# EAGLE schematic analog_effects (EAGLE 9.6.2)

## Sheet 1 of 2
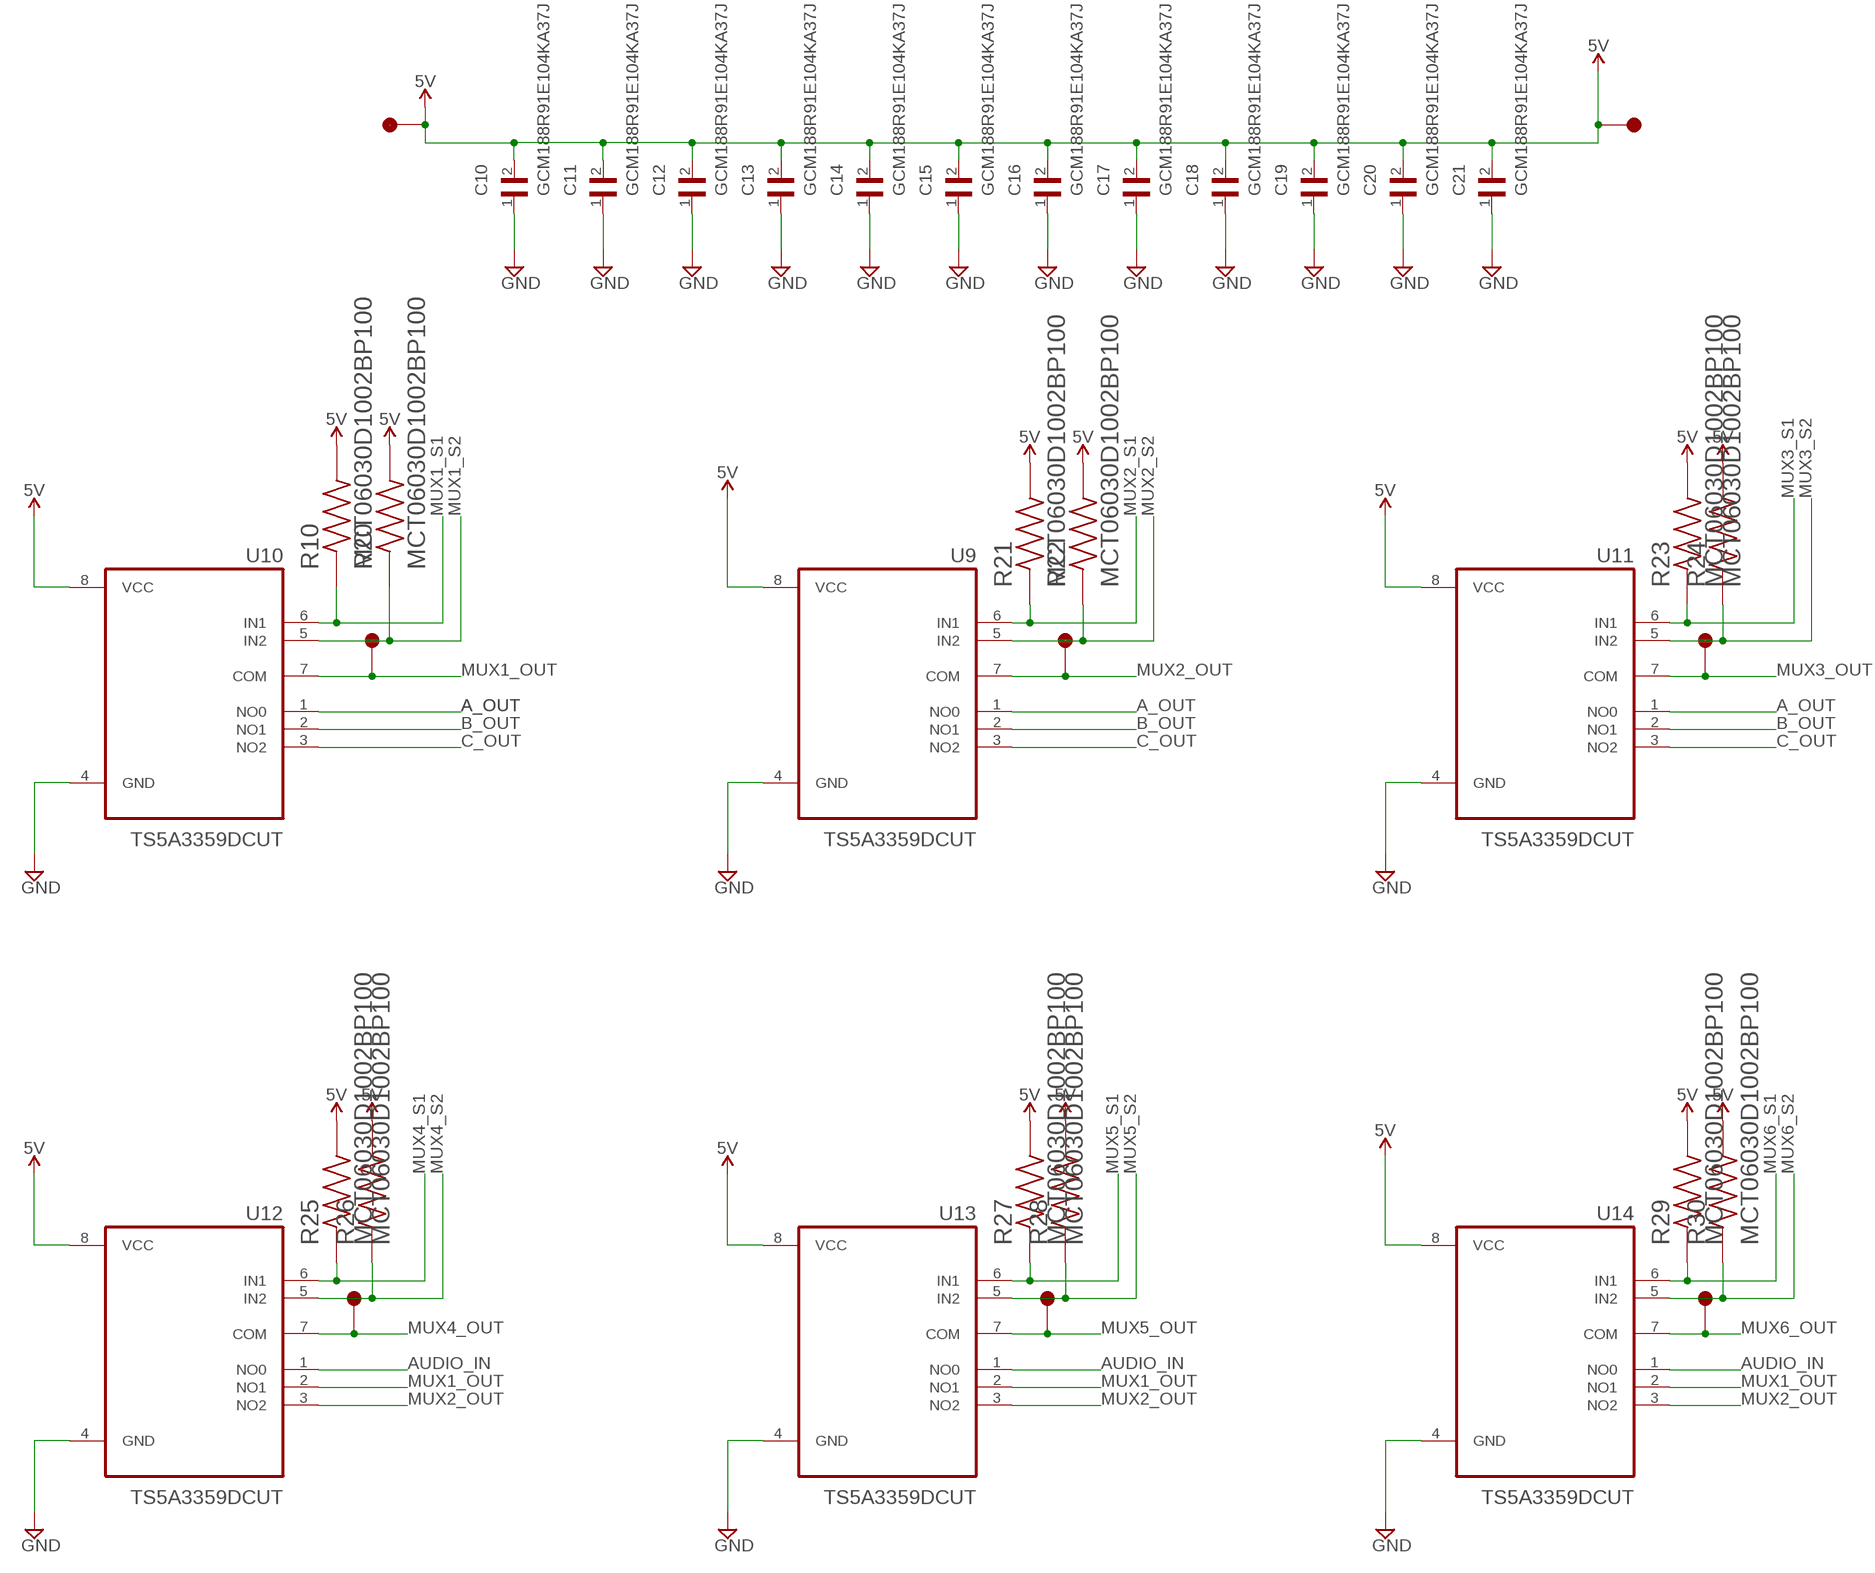
[diagram p0: schematic, sheet 1]

### Parts
C10  GCM188R91E104KA37J  [CAPC1608X90N]
C11  GCM188R91E104KA37J  [CAPC1608X90N]
C12  GCM188R91E104KA37J  [CAPC1608X90N]
C13  GCM188R91E104KA37J  [CAPC1608X90N]
C14  GCM188R91E104KA37J  [CAPC1608X90N]
C15  GCM188R91E104KA37J  [CAPC1608X90N]
C16  GCM188R91E104KA37J  [CAPC1608X90N]
C17  GCM188R91E104KA37J  [CAPC1608X90N]
C18  GCM188R91E104KA37J  [CAPC1608X90N]
C19  GCM188R91E104KA37J  [CAPC1608X90N]
C20  GCM188R91E104KA37J  [CAPC1608X90N]
C21  GCM188R91E104KA37J  [CAPC1608X90N]
R10  MCT06030D1002BP100  [RESC1508X55N]
R20  MCT06030D1002BP100  [RESC1508X55N]
R21  MCT06030D1002BP100  [RESC1508X55N]
R22  MCT06030D1002BP100  [RESC1508X55N]
R23  MCT06030D1002BP100  [RESC1508X55N]
R24  MCT06030D1002BP100  [RESC1508X55N]
R25  MCT06030D1002BP100  [RESC1508X55N]
R26  MCT06030D1002BP100  [RESC1508X55N]
R27  MCT06030D1002BP100  [RESC1508X55N]
R28  MCT06030D1002BP100  [RESC1508X55N]
R29  MCT06030D1002BP100  [RESC1508X55N]
R30  MCT06030D1002BP100  [RESC1508X55N]
TP13  5015  [KEYSTONE_5015]
TP14  5015  [KEYSTONE_5015]
TP15  5015  [KEYSTONE_5015]
TP16  5015  [KEYSTONE_5015]
TP17  5015  [KEYSTONE_5015]
TP18  5015  [KEYSTONE_5015]
TP19  5015  [KEYSTONE_5015]
TP20  5015  [KEYSTONE_5015]
U9  TS5A3359DCUT  [SOP50P310X90-8N]
U10  TS5A3359DCUT  [SOP50P310X90-8N]
U11  TS5A3359DCUT  [SOP50P310X90-8N]
U12  TS5A3359DCUT  [SOP50P310X90-8N]
U13  TS5A3359DCUT  [SOP50P310X90-8N]
U14  TS5A3359DCUT  [SOP50P310X90-8N]

### Nets
5V: C10.2 C11.2 C12.2 C13.2 C14.2 C15.2 C16.2 C17.2 C18.2 C19.2 C20.2 C21.2 R10.2 R20.2 R21.2 R22.2 R23.2 R24.2 R25.2 R26.2 R27.2 R28.2 R29.2 R30.2 TP19.1(TP) TP20.1(TP) U9.8(VCC) U10.8(VCC) U11.8(VCC) U12.8(VCC) U13.8(VCC) U14.8(VCC) ; also sheet 2
A_OUT: U9.1(NO0) U10.1(NO0) U11.1(NO0) ; also sheet 2
AUDIO_IN: U12.1(NO0) U13.1(NO0) U14.1(NO0) ; also sheet 2
B_OUT: U9.2(NO1) U10.2(NO1) U11.2(NO1) ; also sheet 2
C_OUT: U9.3(NO2) U10.3(NO2) U11.3(NO2)
GND: C10.1 C11.1 C12.1 C13.1 C14.1 C15.1 C16.1 C17.1 C18.1 C19.1 C20.1 C21.1 U9.4(GND) U10.4(GND) U11.4(GND) U12.4(GND) U13.4(GND) U14.4(GND) ; also sheet 2
MUX1_OUT: TP16.1(TP) U10.7(COM) U12.2(NO1) U13.2(NO1) U14.2(NO1)
MUX1_S1: R10.1 U10.6(IN1) ; also sheet 2
MUX1_S2: R20.1 U10.5(IN2) ; also sheet 2
MUX2_OUT: TP17.1(TP) U9.7(COM) U12.3(NO2) U13.3(NO2) U14.3(NO2)
MUX2_S1: R21.1 U9.6(IN1) ; also sheet 2
MUX2_S2: R22.1 U9.5(IN2) ; also sheet 2
MUX3_OUT: TP18.1(TP) U11.7(COM)
MUX3_S1: R23.1 U11.6(IN1) ; also sheet 2
MUX3_S2: R24.1 U11.5(IN2) ; also sheet 2
MUX4_OUT: TP13.1(TP) U12.7(COM) ; also sheet 2
MUX4_S1: R25.1 U12.6(IN1) ; also sheet 2
MUX4_S2: R26.1 U12.5(IN2) ; also sheet 2
MUX5_OUT: TP14.1(TP) U13.7(COM) ; also sheet 2
MUX5_S1: R27.1 U13.6(IN1) ; also sheet 2
MUX5_S2: R28.1 U13.5(IN2) ; also sheet 2
MUX6_OUT: TP15.1(TP) U14.7(COM) ; also sheet 2
MUX6_S1: R29.1 U14.6(IN1) ; also sheet 2
MUX6_S2: R30.1 U14.5(IN2) ; also sheet 2

## Sheet 2 of 2
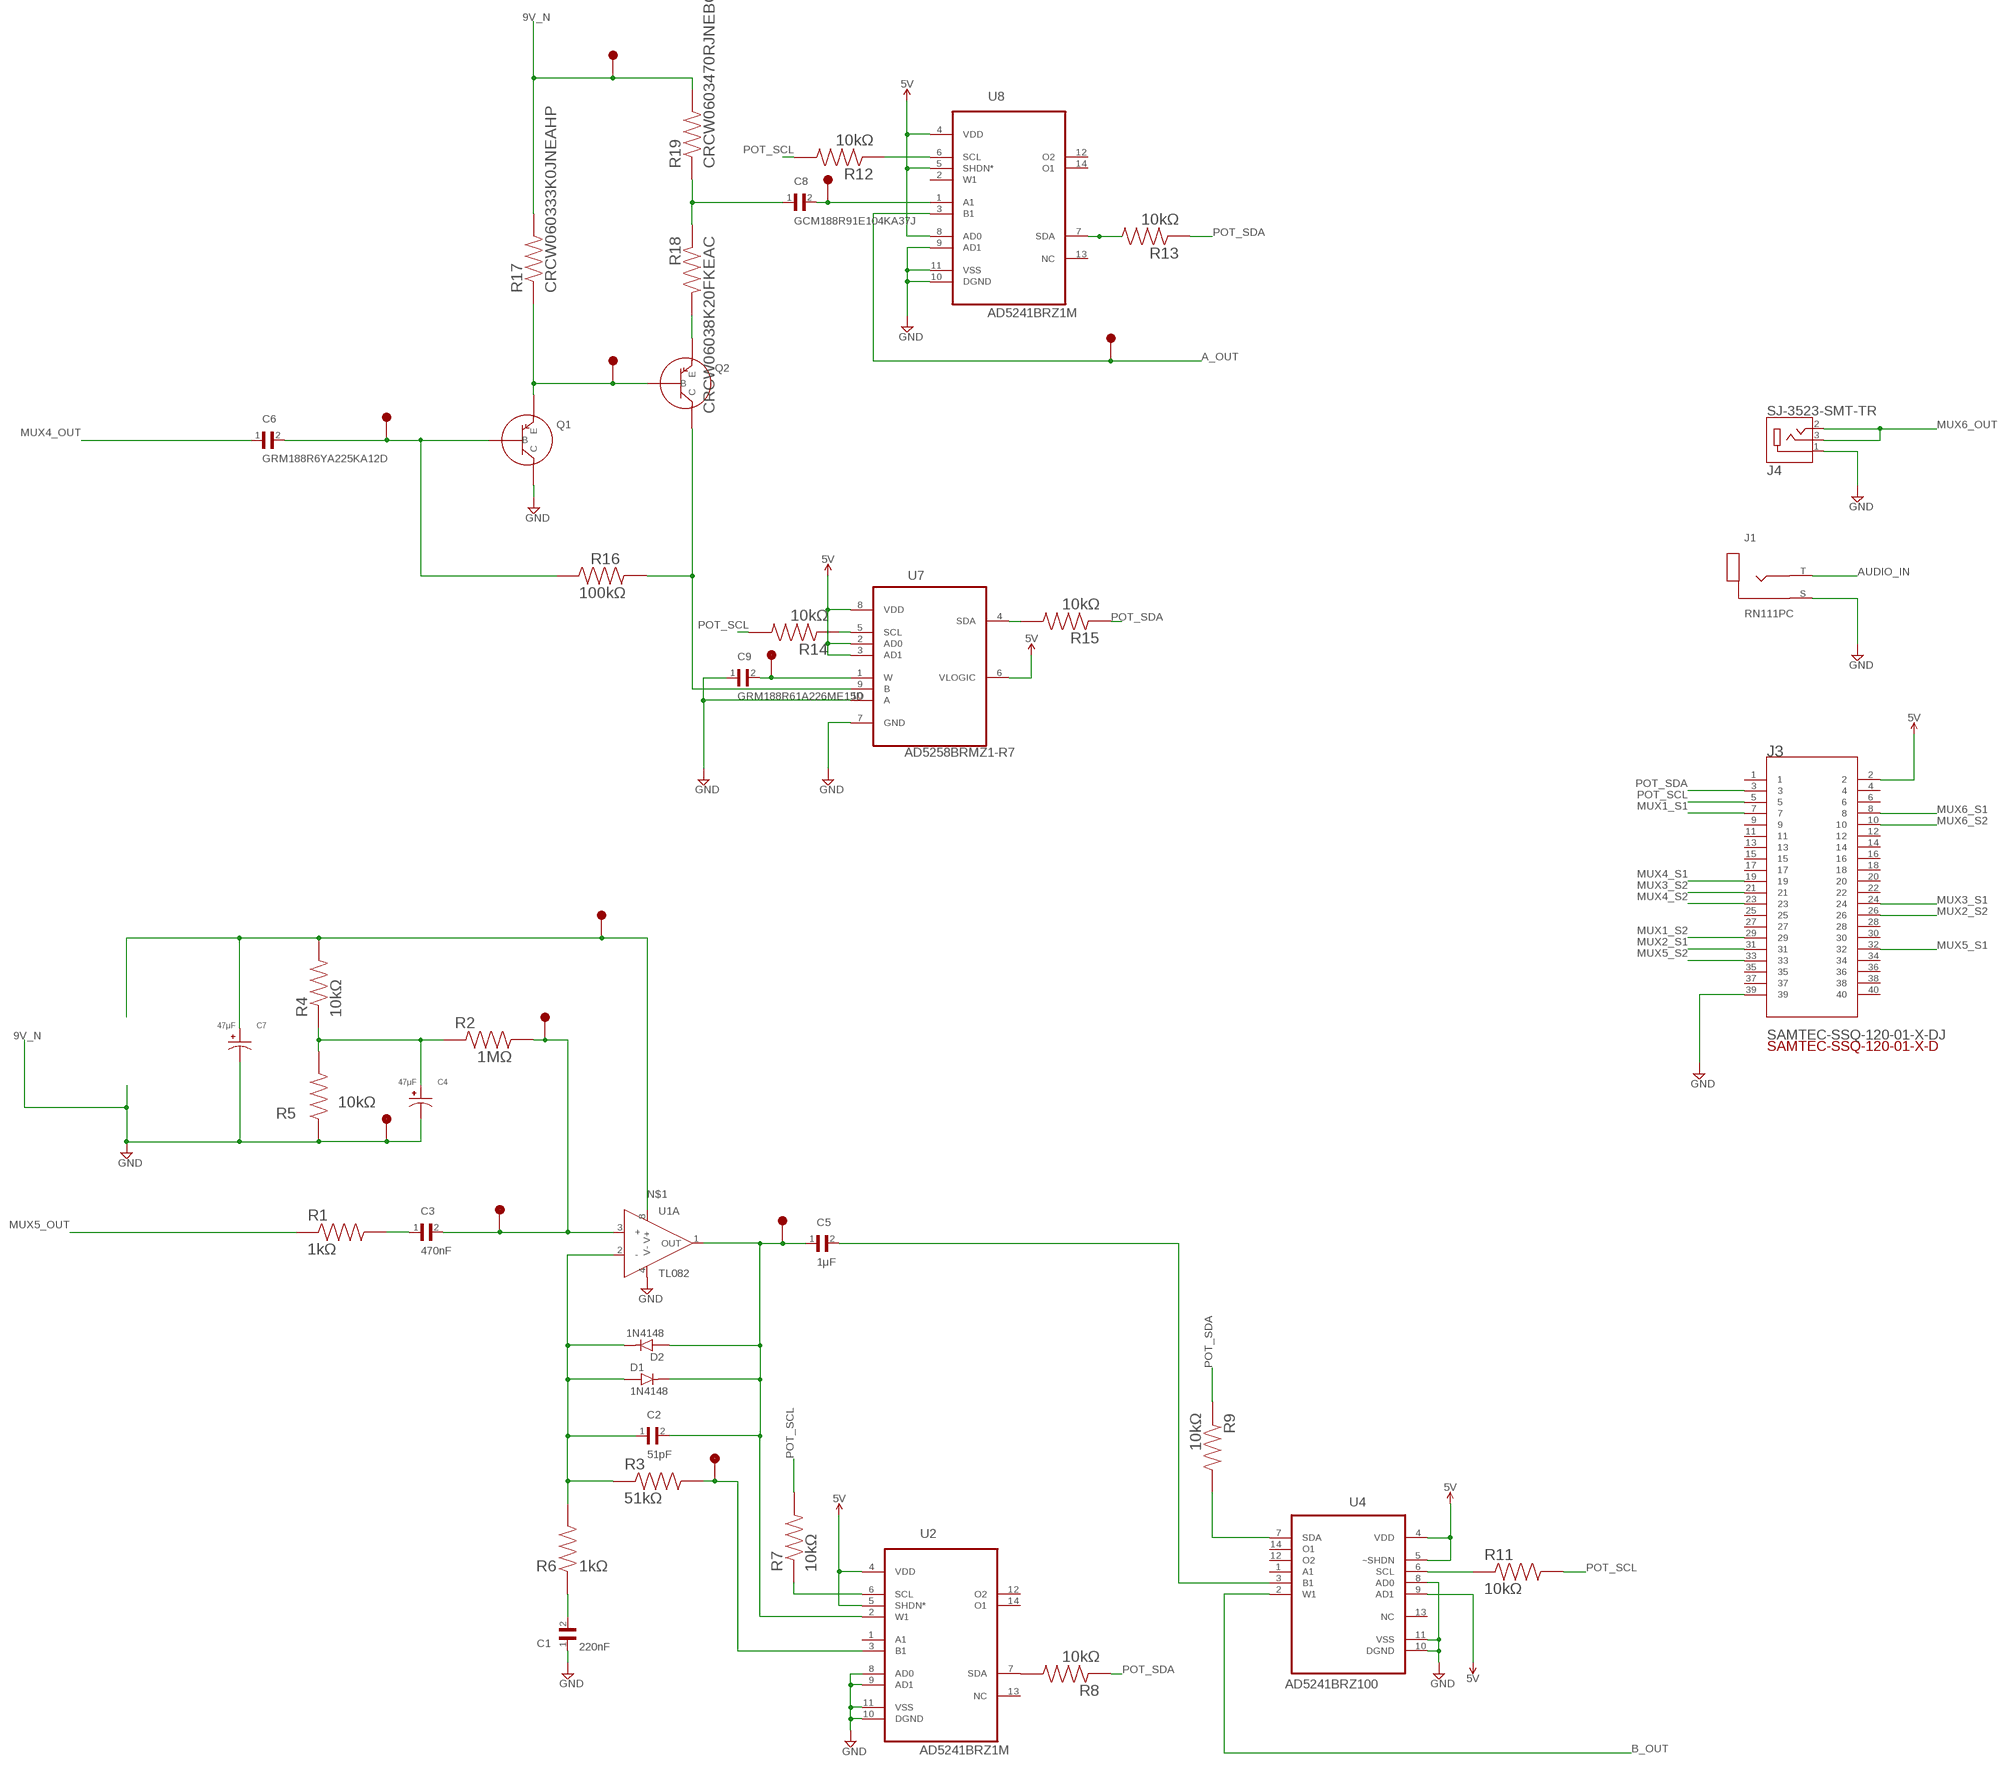
[diagram p1: schematic, sheet 2]

### Parts
C1  220nF  12105C224MAT2A  [CAPC3325X94N]
C2  51pF  C0603C510F1GACTU  [CAPC1608X87N]
C3  470nF  CGA3E3X7R1H474M080AE  [CAPC1608X95N]
C4  47μF  EEE-HC1E470XP  [CAPAE660X800N]
C5  1μF  GCM188R71C105KA64J  [CAPC1608X90N]
C6  GRM188R6YA225KA12D  [CAPC1608X90N]
C7  47μF  EEE-HC1E470XP  [CAPAE660X800N]
C8  GCM188R91E104KA37J  [CAPC1608X90N]
C9  GRM188R61A226ME15D  [CAPC1608X100N]
D1  1N4148  [DIOAD829W49L456D191]
D2  1N4148  [DIOAD829W49L456D191]
J1  RN111PC  [SWITCHCRAFT_RN111PC]
J3  SAMTEC-SSQ-120-01-X-DJ  [SAMTEC-SSQ-120-01-X-D]
J4  SJ-3523-SMT-TR  [CUI_SJ-3523-SMT-TR]
Q1  BJT_PNP  (no package)
Q2  BJT_PNP  (no package)
R1  1kΩ  CPF0603B1K0E1  [RESC1508X55N]
R2  1MΩ  CRCW06031M00JNEAHP  [RESC1608X55N]
R3  51kΩ  CRCW060351K0FKEAC  [RESC1608X55N]
R4  10kΩ  MCT06030D1002BP100  [RESC1508X55N]
R5  10kΩ  MCT06030D1002BP100  [RESC1508X55N]
R6  1kΩ  CPF0603B1K0E1  [RESC1508X55N]
R7  10kΩ  MCT06030D1002BP100  [RESC1508X55N]
R8  10kΩ  MCT06030D1002BP100  [RESC1508X55N]
R9  10kΩ  MCT06030D1002BP100  [RESC1508X55N]
R11  10kΩ  MCT06030D1002BP100  [RESC1508X55N]
R12  10kΩ  MCT06030D1002BP100  [RESC1508X55N]
R13  10kΩ  MCT06030D1002BP100  [RESC1508X55N]
R14  10kΩ  MCT06030D1002BP100  [RESC1508X55N]
R15  10kΩ  MCT06030D1002BP100  [RESC1508X55N]
R16  100kΩ  CRCW0603100KDHEAP  [RESC1508X50N]
R17  CRCW060333K0JNEAHP  [RESC1608X55N]
R18  CRCW06038K20FKEAC  [RESC1608X55N]
R19  CRCW0603470RJNEBC  [RESC1608X55N]
TP1  5015  [KEYSTONE_5015]
TP2  5015  [KEYSTONE_5015]
TP3  5015  [KEYSTONE_5015]
TP4  5015  [KEYSTONE_5015]
TP5  5015  [KEYSTONE_5015]
TP6  5015  [KEYSTONE_5015]
TP7  5015  [KEYSTONE_5015]
TP8  5015  [KEYSTONE_5015]
TP9  5015  [KEYSTONE_5015]
TP10  5015  [KEYSTONE_5015]
TP11  5015  [KEYSTONE_5015]
TP12  5015  [KEYSTONE_5015]
U1  TL082  [SOIC127P600X175-8N]
U2  AD5241BRZ1M  [SOIC127P600X175-14N]
U4  AD5241BRZ100  [SOIC127P600X175-14N]
U7  AD5258BRMZ1-R7  [SOP50P490X110-10N]
U8  AD5241BRZ1M  [SOIC127P600X175-14N]

### Nets
5V: J3.2 U2.4(VDD) U2.5(SHDN*) U4.4(VDD) U4.5(~SHDN) U4.9(AD1) U7.2(AD0) U7.3(AD1) U7.6(VLOGIC) U7.8(VDD) U8.4(VDD) U8.5(SHDN*) U8.8(AD0) ; also sheet 1
9V_N: C4.2 C7.2 R5.1 R17.2 R19.2 TP2.1(TP) TP9.1(TP) ; supply symbol labelled GND
A_OUT: TP12.1(TP) U8.3(B1) ; also sheet 1
AUDIO_IN: J1.T ; also sheet 1
B_OUT: U4.2(W1) ; also sheet 1
GND: C1.1 C9.1 J1.S J3.39 J4.1 Q1.C U1.4(A:V-) U2.8(AD0) U2.9(AD1) U2.10(DGND) U2.11(VSS) U4.8(AD0) U4.10(DGND) U4.11(VSS) U7.7(GND) U7.10(A) U8.9(AD1) U8.10(DGND) U8.11(VSS) ; also sheet 1
MUX1_S1: J3.7 ; also sheet 1
MUX1_S2: J3.29 ; also sheet 1
MUX2_S1: J3.31 ; also sheet 1
MUX2_S2: J3.26 ; also sheet 1
MUX3_S1: J3.24 ; also sheet 1
MUX3_S2: J3.21 ; also sheet 1
MUX4_OUT: C6.1 ; also sheet 1
MUX4_S1: J3.19 ; also sheet 1
MUX4_S2: J3.23 ; also sheet 1
MUX5_OUT: R1.1 ; also sheet 1
MUX5_S1: J3.32 ; also sheet 1
MUX5_S2: J3.33 ; also sheet 1
MUX6_OUT: J4.2 J4.3 ; also sheet 1
MUX6_S1: J3.8 ; also sheet 1
MUX6_S2: J3.10 ; also sheet 1
N$1: C7.1 R4.2 TP5.1(TP) U1.8(A:V+)
N$2: C4.1 R2.1 R4.1 R5.2
N$3: C2.1 D1.A D2.C R3.1 R6.2 U1.2(A:-)
N$4: C3.1 R1.2
N$5: C2.2 C5.1 D1.C D2.A TP1.1(TP) U1.1(A:OUT) U2.2(W1)
N$6: C3.2 R2.2 TP3.1(TP) TP4.1(TP) U1.3(A:+)
N$7: C1.2 R6.1
N$8: Q2.E R18.2
N$9: C6.2 Q1.B R16.1 TP7.1(TP)
N$10: Q1.E Q2.B R17.1 TP8.1(TP)
N$12: R8.2 U2.7(SDA)
N$13: R3.2 TP6.1(TP) U2.3(B1)
N$14: R12.1 U8.6(SCL)
N$15: R9.2 U4.7(SDA)
N$17: R7.1 U2.6(SCL)
N$18: C8.1 R18.1 R19.1
N$19: R13.2 U8.7(SDA)
N$20: R14.1 U7.5(SCL)
N$21: R11.1 U4.6(SCL)
N$22: C5.2 U4.3(B1)
N$23: R15.2 U7.4(SDA)
N$28: Q2.C R16.2 U7.9(B)
N$29: C9.2 TP11.1(TP) U7.1(W)
N$30: C8.2 TP10.1(TP) U8.1(A1)
POT_SCL: J3.5 R7.2 R11.2 R12.2 R14.2
POT_SDA: J3.3 R8.1 R9.1 R13.1 R15.1
Unconnected: J3.1 J3.4 J3.6 J3.9 J3.11 J3.12 J3.13 J3.14 J3.15 J3.16 J3.17 J3.18 J3.20 J3.22 J3.25 J3.27 J3.28 J3.30 J3.34 J3.35 J3.36 J3.37 J3.38 J3.40 U1.5(+) U1.6(-) U1.7(OUT) U2.1(A1) U2.12(O2) U2.13(NC) U2.14(O1) U4.1(A1) U4.12(O2) U4.13(NC) U4.14(O1) U8.2(W1) U8.12(O2) U8.13(NC) U8.14(O1)

## Library data of the parts
C1 = 12105C224MAT2A:12105C224MAT2A: Cap Ceramic 0.22uF 50V X7R 20% SMD 1210 125°C Paper T/R Check prices <https://pricing.snapeda.com/parts/12105C224MAT2A/AVX/view-part?ref=eda>; AVAILABILITY: Good; DESCRIPTION: 1210 220 nF 50 V ±20 % Tolerance X7R SMT Multilayer Ceramic Capacitor; MF: AVX; MP: 12105C224MAT2A; PACKAGE: 3325 AVX; PRICE: None; PURCHASE-URL: https://pricing.snapeda.com/search/part/12105C224MAT2A/?ref=eda
C2 = C0603C510F1GACTU:C0603C510F1GACTU: Cap Ceramic 51pF 100V C0G 1% SMD 0603 125°C Paper T/R Check prices <https://pricing.snapeda.com/parts/C0603C510F1GACTU/KEMET/view-part?ref=eda>; AVAILABILITY: Bad; DESCRIPTION: Cap Ceramic 51pF 100V C0G 1% Pad SMD 0603 125°C Extreme Low ESR T/R; MF: KEMET; MP: C0603C510F1GACTU; PACKAGE: 1608 KEMET; PRICE: None
C3 = CGA3E3X7R1H474M080AE:CGA3E3X7R1H474M080AE: Cap Ceramic 0.47uF 50V X7R 20% Pad SMD 0603 125C Automotive T/R Check prices <https://pricing.snapeda.com/parts/CGA3E3X7R1H474M080AE/TDK/view-part?ref=eda>; AVAILABILITY: Good; DESCRIPTION: CGA Series 0603 470 nF 50 V ±20 % Tolerance X7R SMT Multilayer Ceramic Capacitor; MF: TDK; MP: CGA3E3X7R1H474M080AE; PACKAGE: 1608 TDK; PRICE: None; PURCHASE-URL: https://pricing.snapeda.com/search/part/CGA3E3X7R1H474M080AE/?ref=eda
C4 C7 = EEE-HC1E470XP:EEE-HC1E470XP: 47µF 25V Aluminum Electrolytic Capacitors Radial, Can - SMD 3000 Hrs @ 105°C Check prices <https://pricing.snapeda.com/parts/EEE-HC1E470XP/Panasonic%20Electronic/view-part?ref=eda>; AVAILABILITY: Good; DESCRIPTION: 47µF 25V Aluminum Electrolytic Capacitors Radial, Can - SMD 3000 Hrs @ 105°C; MF: Panasonic Electronic; MP: EEE-HC1E470XP; PACKAGE: Radial Panasonic; PRICE: None; PURCHASE-URL: https://pricing.snapeda.com/search/part/EEE-HC1E470XP/?ref=eda
C5 = GCM188R71C105KA64J:GCM188R71C105KA64J: Check prices <https://pricing.snapeda.com/parts/GCM188R71C105KA64J/Murata/view-part?ref=eda>; AVAILABILITY: Good; DESCRIPTION: SMD Capacitor X7R(EIA) with Capacitance: 1.0uF Tol. 10%. Rated Voltage: 16Vdc; MF: Murata; MP: GCM188R71C105KA64J; PACKAGE: 1608 Murata; PRICE: None; PURCHASE-URL: https://pricing.snapeda.com/search/part/GCM188R71C105KA64J/?ref=eda
C6 = GRM188R6YA225KA12D:GRM188R6YA225KA12D: SMD Capacitor X5R(EIA) with Capacitance: 2.2uF Tol. 10%. Rated Voltage: 35Vdc Check prices <https://pricing.snapeda.com/parts/GRM188R6YA225KA12D/Murata/view-part?ref=eda>; AVAILABILITY: Warning; DESCRIPTION: SMD capacitor X5R(EIA) with capacitance 2.2uF Tol.10%. Rated voltage 35Vdc 85C; MF: Murata; MP: GRM188R6YA225KA12D; PACKAGE: 1608 Murata; PRICE: None; PURCHASE-URL: https://pricing.snapeda.com/search/part/GRM188R6YA225KA12D/?ref=eda
C8 C10-C21 = GCM188R91E104KA37J:GCM188R91E104KA37J: SMD Capacitor X8R(EIA) with Capacitance: 0.10uF Tol. 10%. Rated Voltage: 25Vdc Check prices <https://pricing.snapeda.com/parts/GCM188R91E104KA37J/Murata/view-part?ref=eda>; AVAILABILITY: Warning; DESCRIPTION: SMD capacitor X8R(EIA) with capacitance 0.10uF Tol.10%. Rated voltage 25Vdc 150C; MF: Murata; MP: GCM188R91E104KA37J; PACKAGE: 1608 Murata; PRICE: None; PURCHASE-URL: https://pricing.snapeda.com/search/part/GCM188R91E104KA37J/?ref=eda
C9 = GRM188R61A226ME15D:GRM188R61A226ME15D: SMD Capacitor X5R(EIA) with Capacitance: 22uF Tol. 20%. Rated Voltage: 10Vdc Check prices <https://pricing.snapeda.com/parts/GRM188R61A226ME15D/Murata%20Electronics/view-part?ref=eda>; AVAILABILITY: Good; DESCRIPTION: SMD capacitor X5R(EIA) with capacitance 22uF Tol.20%. Rated voltage 10Vdc 85C; MF: Murata Electronics; MP: GRM188R61A226ME15D; PACKAGE: 1608 Murata; PRICE: None; PURCHASE-URL: https://pricing.snapeda.com/search/part/GRM188R61A226ME15D/?ref=eda
D1 D2 = 1N4148:1N4148: Small Signal Fast Switching Diodes Check prices <https://pricing.snapeda.com/parts/1N4148/ON%20Semiconductor/view-part?ref=eda>; AVAILABILITY: Good; DESCRIPTION: Diode Standard 100V 200mA Through Hole DO-35; MF: ON Semiconductor; MP: 1N4148; PACKAGE: AXIAL LEAD-2 ON Semiconductor; PRICE: None; PURCHASE-URL: https://pricing.snapeda.com/search/part/1N4148/?ref=eda
J1 = RN111PC:RN111PC: Connector 1/4" Phone Jack F 2 POS 7.62mm Solder RA Thru-Hole 5 Terminal 1 Port Check prices <https://pricing.snapeda.com/parts/RN111PC/Switchcraft/view-part?ref=eda>; AVAILABILITY: Good; DESCRIPTION: 6.35mm (0.250, 1/4) - Headphone Phone Jack Mono Connector Solder; MF: Switchcraft; MP: RN111PC; PACKAGE: None; PRICE: None; PURCHASE-URL: https://pricing.snapeda.com/search/part/RN111PC/?ref=eda
J3 = SAMTEC-SSQ-120-01-X-D:SAMTEC-SSQ-120-01-X-D: Check prices <https://pricing.snapeda.com/parts/SSQ-120-01-G-D-LL/Samtec/view-part?ref=eda>; AVAILABILITY: Bad; DESCRIPTION: CONN RCPT 40POS 0.1 GOLD PCB; MF: Samtec; MP: SSQ-120-01-G-D-LL; PACKAGE: None; PRICE: None; PURCHASE-URL: https://pricing.snapeda.com/search/part/SSQ-120-01-G-D-LL/?ref=eda
J4 = SJ-3523-SMT-TR:SJ-3523-SMT-TR: Audio Jack Connector 3.5 mm Low Profile Surface Mount Stereo Jack, 3 Pin Right-Angle Check prices <https://pricing.snapeda.com/parts/SJ-3523-SMT-TR/CUI%20Devices/view-part?ref=eda>; AVAILABILITY: Good; CUI_PURCHASE_URL: https://www.cuidevices.com/product/interconnect/connectors/audio-connectors/jacks/sj-352x-smt-series?utm_source=snapeda.com&utm_medium=referral&utm_campaign=snapedaBOM; DESCRIPTION: 3.5 mm, Stereo, Right Angle, Surface Mount (SMT), 3 Conductors, 0~1 Internal Switches, Audio Jack Connector; MF: CUI Devices; MP: SJ-3523-SMT-TR; PACKAGE: LGA-10 STMicroelectronics; PRICE: None; PURCHASE-URL: https://pricing.snapeda.com/search/part/SJ-3523-SMT-TR/?ref=eda
Q1 Q2 = ngspice-simulation:BJT_PNP: Bipolar PNP Transistor
R1 R6 = CPF0603B1K0E1:CPF0603B1K0E1: Res Thin Film 0603 1K Ohm 0.1% 0.063W(1/16W) ±25ppm/C Epoxy Pad SMD T/R Check prices <https://pricing.snapeda.com/parts/CPF0603B1K0E1/TE%20Connectivity/view-part?ref=eda>; AVAILABILITY: Good; COMMENT: 1614882-3; DESCRIPTION: Res Thin Film 0603 1K Ohm 0.1% 0.063W(1/16W) ±25ppm/C Epoxy Pad SMD T/R; EU_ROHS_COMPLIANCE: Compliant; MF: TE Connectivity; MP: CPF0603B1K0E1; PACKAGE: 0603; POWER_RATING: .063 W; PRICE: None; PURCHASE-URL: https://pricing.snapeda.com/search/part/CPF0603B1K0E1/?ref=eda; RESISTANCE: 1K; TOLERANCE: .1%; VOLTAGE_RATING: 50 V
R2 = CRCW06031M00JNEAHP:CRCW06031M00JNEAHP: Res Thick Film 0603 1M Ohm 5% 0.25W(1/4W) ±200ppm/C Pad SMD Automotive T/R Check prices <https://pricing.snapeda.com/parts/CRCW06031M00JNEAHP/Vishay%20Dale/view-part?ref=eda>; AVAILABILITY: Good; DESCRIPTION: Res Thick Film 0603 1M Ohm 5% 0.25W(1/4W) ±200ppm/C Pad SMD Automotive T/R; MF: Vishay Dale; MP: CRCW06031M00JNEAHP; PACKAGE: 1608 Vishay; PRICE: None; PURCHASE-URL: https://pricing.snapeda.com/search/part/CRCW06031M00JNEAHP/?ref=eda
R3 = CRCW060351K0FKEAC:CRCW060351K0FKEAC: Check prices <https://pricing.snapeda.com/parts/CRCW060351K0FKEAC/Vishay/view-part?ref=eda>; AVAILABILITY: Warning; DESCRIPTION: Res Thick Film 0603 51K Ohm 1% 0.1W(1/10W) ±100ppm/°C Pad SMD T/R; MF: Vishay; MP: CRCW060351K0FKEAC; PACKAGE: 1608 Rohm Semiconductor; PRICE: None; PURCHASE-URL: https://pricing.snapeda.com/search/part/CRCW060351K0FKEAC/?ref=eda
R4 R5 R7-R15 R20-R30 = MCT06030D1002BP100:MCT06030D1002BP100: 10K OHM .1% 25PPM Check prices <https://pricing.snapeda.com/parts/MCT06030D1002BP100/Vishay/view-part?ref=eda>; AVAILABILITY: Warning; DESCRIPTION: Res Thin Film 0603 10K Ohm 0.1% 0.1W(1/10W) ±25ppm/C Molded SMD Automotive Medical Paper T/R; MF: Vishay; MP: MCT06030D1002BP100; PACKAGE: 1508 Vishay; PRICE: None; PURCHASE-URL: https://pricing.snapeda.com/search/part/MCT06030D1002BP100/?ref=eda
R16 = CRCW0603100KDHEAP:CRCW0603100KDHEAP: Res Thick Film 0603 100K Ohm 0.5% 1/10W ±50ppm/°C Molded SMD SMD Paper T/R Check prices <https://pricing.snapeda.com/parts/CRCW0603100KDHEAP/Vishay%20Dale/view-part?ref=eda>; AVAILABILITY: Good; DESCRIPTION: Res Thick Film 0603 100K Ohm 0.5% 0.1W(1/10W) ±50ppm/C Pad SMD Automotive T/R; MF: Vishay Dale; MP: CRCW0603100KDHEAP; PACKAGE: 1508 Vishay; PRICE: None; PURCHASE-URL: https://pricing.snapeda.com/search/part/CRCW0603100KDHEAP/?ref=eda
R17 = CRCW060333K0JNEAHP:CRCW060333K0JNEAHP: Check prices <https://pricing.snapeda.com/parts/CRCW060333K0JNEAHP/Vishay/view-part?ref=eda>; AVAILABILITY: Warning; DESCRIPTION: RES SMD 33K OHM 5% 1/4W 0603; MF: Vishay; MP: CRCW060333K0JNEAHP; PACKAGE: 1608 Vishay; PRICE: None; PURCHASE-URL: https://pricing.snapeda.com/search/part/CRCW060333K0JNEAHP/?ref=eda
R18 = CRCW06038K20FKEAC:CRCW06038K20FKEAC: Check prices <https://pricing.snapeda.com/parts/CRCW06038K20FKEAC/Vishay/view-part?ref=eda>; AVAILABILITY: Warning; DESCRIPTION: Res Thick Film 0603 8.2K Ohm 1% 0.1W(1/10W) ±100ppm/°C Pad SMD T/R; MF: Vishay; MP: CRCW06038K20FKEAC; PACKAGE: 1608 Rohm Semiconductor; PRICE: None; PURCHASE-URL: https://pricing.snapeda.com/search/part/CRCW06038K20FKEAC/?ref=eda
R19 = CRCW0603470RJNEBC:CRCW0603470RJNEBC: Check prices <https://pricing.snapeda.com/parts/CRCW0603470RJNEBC/Vishay/view-part?ref=eda>; AVAILABILITY: Good; DESCRIPTION: 470 Ohms ±5% 0.1W, 1/10W Chip Resistor 0603 (1608 Metric) Thick Film; MF: Vishay; MP: CRCW0603470RJNEBC; PACKAGE: 1608 Rohm Semiconductor; PRICE: None; PURCHASE-URL: https://pricing.snapeda.com/search/part/CRCW0603470RJNEBC/?ref=eda
TP1-TP20 = 5015:5015: Test Point; Black; Surface Mount; Wire Leaded; Polycarbonate; 0.04 in.; DESCRIPTION: SMT Test Point- Micro Miniature-1000 pc Reels; MF: Keystone Electronics; MP: 5015; PACKAGE: Test Point Keystone Electronics; PURCHASE-URL: https://pricing.snapeda.com/search/part/5015/?ref=eda
U1 = TL082:TL082: IC OP AMP WIDEBAND JFET; AVAILABILITY: Unavailable; DESCRIPTION: J-FET Amplifier 2 Circuit 8-SOIC; MF: STMicroelectronics; MP: TL082; PACKAGE: SOIC-8 STMicroelectronics; PRICE: None
U2 U8 = AD5241BRZ1M:AD5241BRZ1M: I2C Compatible Digital Potentiometer Check prices <https://pricing.snapeda.com/parts/AD5241BRZ1M/Analog%20Devices/view-part?ref=eda>; AVAILABILITY: Good; DESCRIPTION: Digital Potentiometer 1M Ohm 1 Circuit 256 Taps I²C Interface 14-SOIC; MF: Analog Devices; MP: AD5241BRZ1M; PACKAGE: SOIC-14 Analog Devices; PRICE: None; PURCHASE-URL: https://pricing.snapeda.com/search/part/AD5241BRZ1M/?ref=eda
U4 = AD5241BRZ100:AD5241BRZ100: I2C-Compatible,256-Position Digital Potentiometers Check prices <https://pricing.snapeda.com/parts/AD5241BRZ100/Analog%20Devices/view-part?ref=eda>; AVAILABILITY: Good; DESCRIPTION: Digital Potentiometer 100k Ohm 1 Circuit 256 Taps I²C Interface 14-SOIC; MF: Analog Devices; MP: AD5241BRZ100; PACKAGE: SOIC-14 Analog Devices; PRICE: None; PURCHASE-URL: https://pricing.snapeda.com/search/part/AD5241BRZ100/?ref=eda
U7 = AD5258BRMZ1-R7:AD5258BRMZ1-R7: Nonvolatile, I2C-Compatible 64-Position, Digital Pot Check prices <https://pricing.snapeda.com/parts/AD5258BRMZ1-R7/Analog%20Devices%20Inc./view-part?ref=eda>; AVAILABILITY: Good; DESCRIPTION: Digital Potentiometer 1k Ohm 1 Circuit 64 Taps I²C Interface 10-MSOP; MF: Analog Devices Inc.; MP: AD5258BRMZ1-R7; PACKAGE: None; PRICE: None; PURCHASE-URL: https://pricing.snapeda.com/search/part/AD5258BRMZ1-R7/?ref=eda
U9-U14 = TS5A3359DCUT:TS5A3359DCUT; DESCRIPTION: 1-?, 5-V, 3:1 (SP3T), 1-channel analog multiplexer 8-VSSOP -40 to 85; DIGI-KEY_PART_NUMBER: 296-32595-1-ND; MF: Texas Instruments; MP: TS5A3359DCUT; PACKAGE: VSSOP-8 Texas Instruments; PURCHASE-URL: https://pricing.snapeda.com/search/part/TS5A3359DCUT/?ref=eda